# Altium schematic sheet hall.SchDoc: Abacus main pcb - Hall sensors
size A4; DrawnBy: Posheng Cheng; SheetNumber: 3; SheetTotal: 3
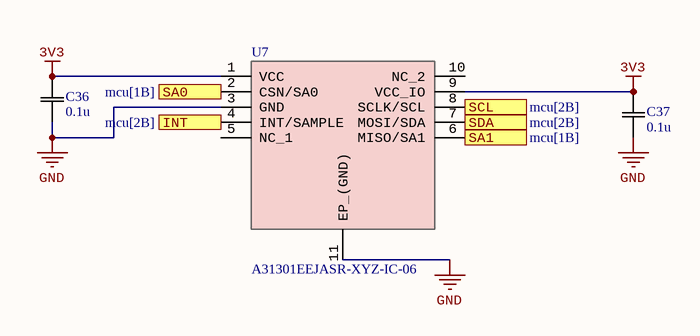
[diagram p0: hall.SchDoc]

## Parts
C36  0.1u  [CAP_CC0201_YAG]
C37  0.1u  [CAP_CC0201_YAG]
U7  A31301EEJASR-XYZ-IC-06  [SON50P300X300X80-11N-D]

## Ports
INT (out, see mcu[2B]), SA0 (in, see mcu[1B]), SA1 (in, see mcu[1B]), SCL (in, see mcu[2B]), SDA (in, see mcu[2B])

## Nets
3V3: C36.2 C37.2 U7.1(VCC) U7.9(VCC_IO)
GND: C36.1 C37.1 U7.3(GND) U7.11(EP_(GND))
INT: U7.4(INT/SAMPLE) ; port INT
SA0: U7.2(CSN/SA0) ; port SA0
SA1: U7.6(MISO/SA1) ; port SA1
SCL: U7.8(SCLK/SCL) ; port SCL
SDA: U7.7(MOSI/SDA) ; port SDA

Not connected (* = marked no-connect by the designer): U7 5(NC_1) 10(NC_2)

## Library data of the parts
C36 C37 = CMP-001-00086-1: Description; Manufacturer_Name: Yageo; Copyright: Copyright (C) 2025 Ultra Librarian. All rights reserved.; Design Item ID: CC0201KRX5R7BB104; Manufacturer_Part_Number: CC0201KRX5R7BB104; Source: CC0201KRX5R7BB104.SchLib
U7 = A31301EEJASR-XYZ-IC-06: 3D Linear Hall-Effect Sensor with SPI, I2C Interfaces, and Advanced Low-Power Management; Manufacturer_Name: Allegro Microsystems; Geometry.Height: 0.8mm; Manufacturer_Part_Number: A31301EEJASR-XYZ-IC-06; Mouser Part Number: 250-A31301EEJASRIC06; Mouser Price/Stock: https://www.mouser.co.uk/ProductDetail/Allegro-MicroSystems/A31301EEJASR-XYZ-IC-06?qs=ST9lo4GX8V09bDUIBZAaKw%3D%3D; Arrow Part Number: A31301EEJASR-XYZ-IC-06; Arrow Price/Stock: https://www.arrow.com/en/products/a31301eejasr-xyz-ic-06/allegro-microsystems?utm_currency=USD&region=nac; Datasheet Link: https://www.allegromicro.com/en/